# EAGLE design op-synth 0.83 bigger mounting holes (EAGLE 6.6.0)
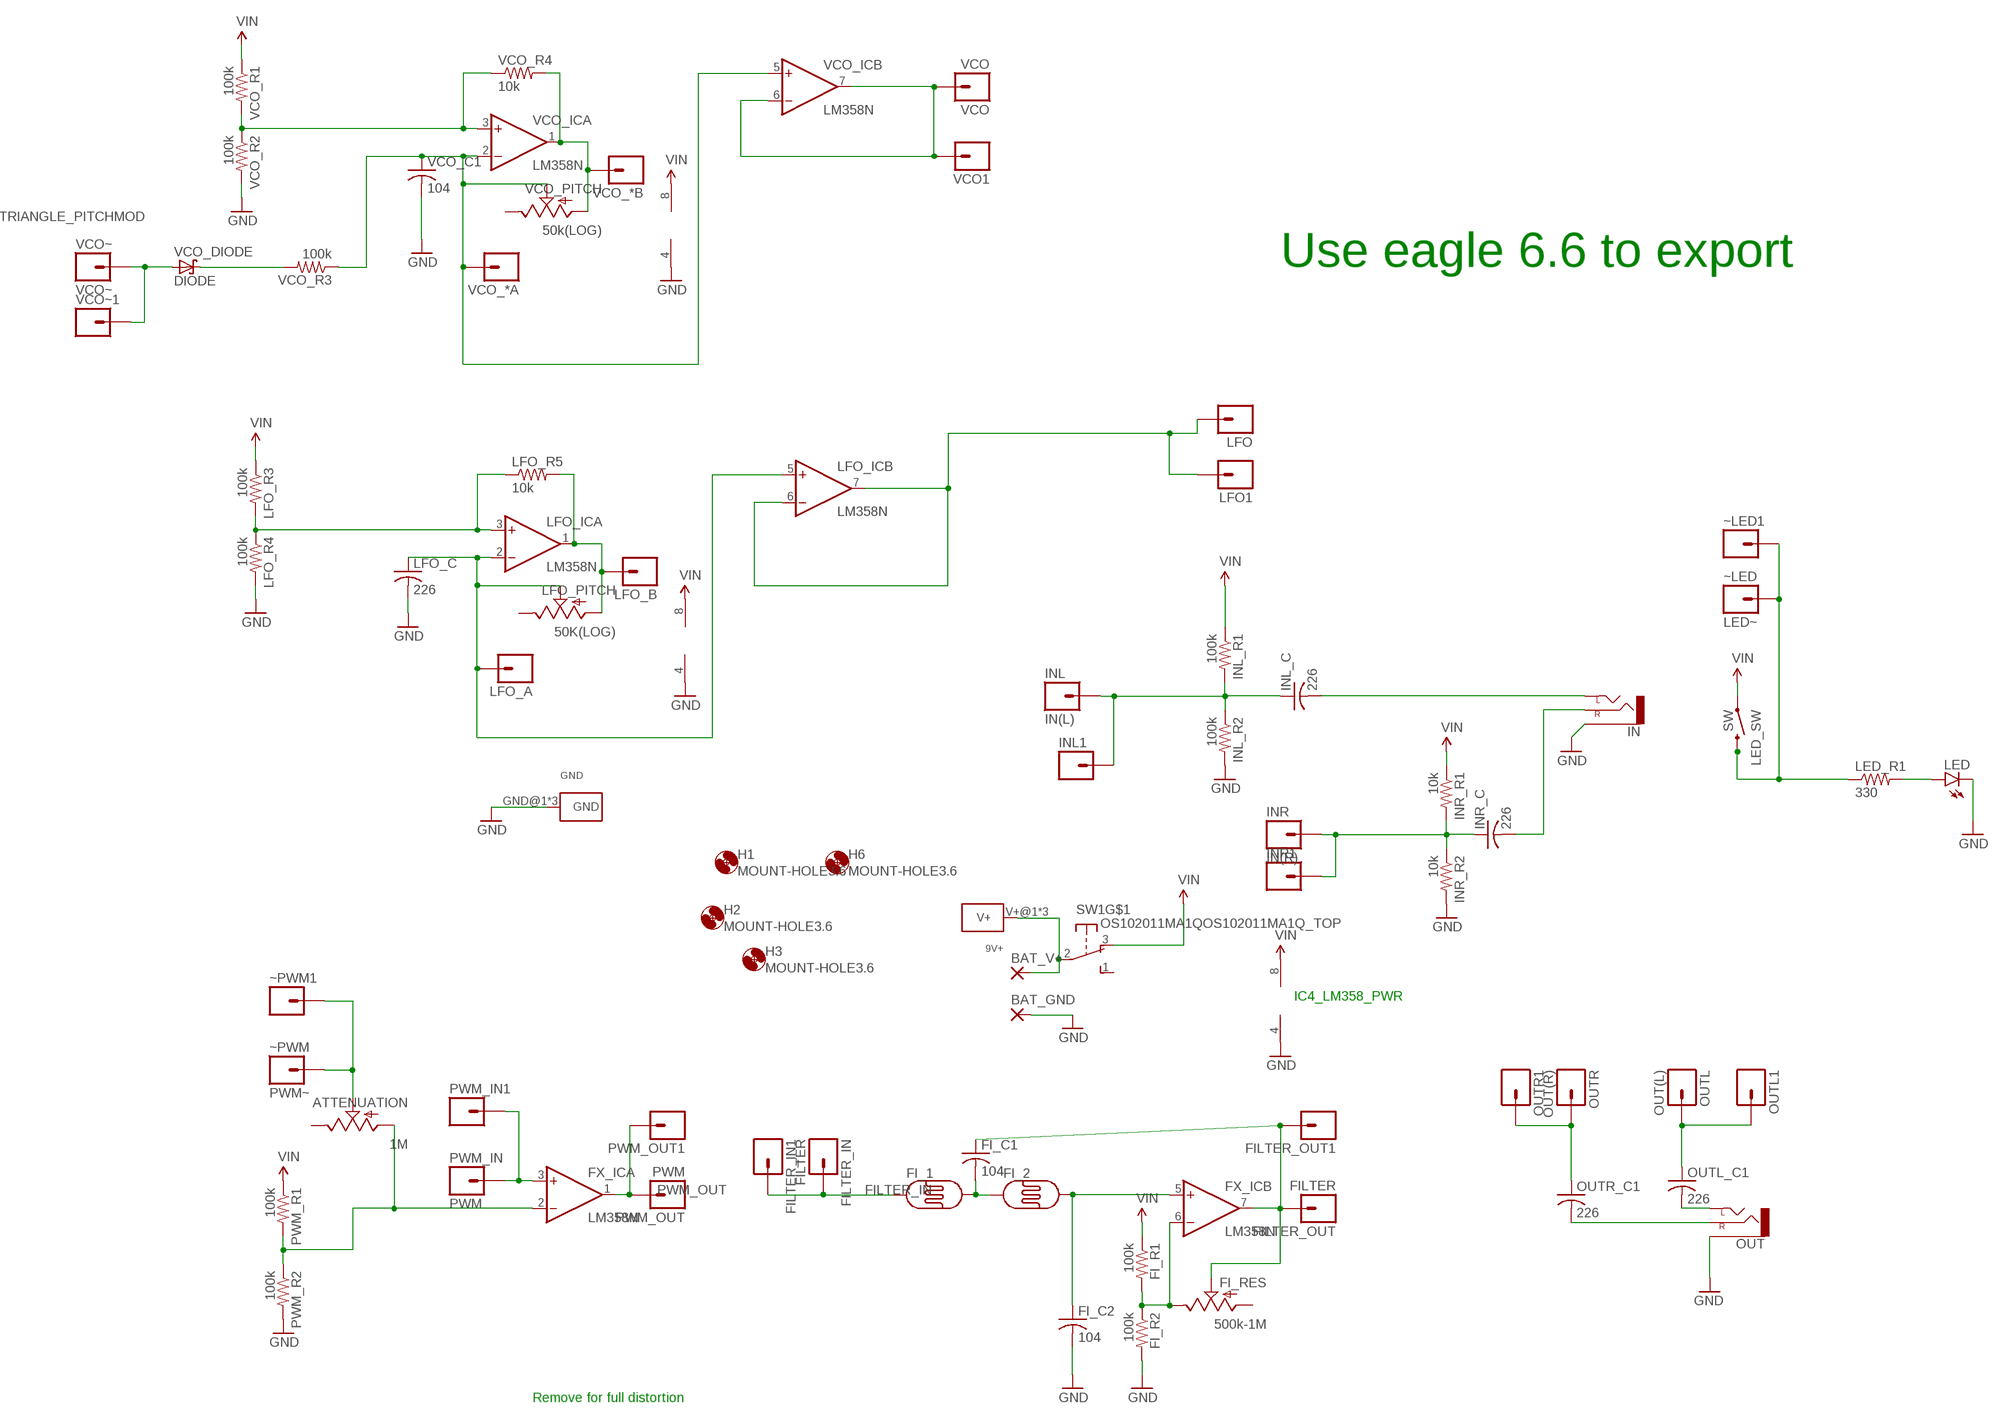
[diagram p0: schematic, sheet 1]

## Parts
9V+  KEYSTONE-629+  [KEYSTONE_BATTAERY_TERMINAL-629+]
ATTENUATION  1M  POTTRIM  [TRIM_POT]
BAT_GND  3,81/1,4  [3,81/1,4]
BAT_V+  3,81/1,4  [3,81/1,4]
FI_1  PHOTOCELLPTH  [PHOTOCELL]
FI_2  PHOTOCELLPTH  [PHOTOCELL]
FI_C1  104  C-US050-024X044  [C050-024X044]
FI_C2  104  C-US050-024X044  [C050-024X044]
FI_R1  100k  R-US_0204/7  [0204/7]
FI_R2  100k  R-US_0204/7  [0204/7]
FI_RES  500k-1M  POT  [ALPS_POT]
FILTER_IN  FILTER  HEADER-1X1  [1X01_SIDE_NAME]
FILTER_IN1  HEADER-1X1  [1X01_SIDE_NAME]
FILTER_OUT  FILTER  HEADER-1X1  [1X01_SIDE_NAME]
FILTER_OUT1  HEADER-1X1  [1X01_SIDE_NAME]
FX_IC  LM358N  [DIL08]
GND  KEYSTONE-629  [KEYSTONE_AA_AAA_BATTERY_TERMINAL-629]
H1  MOUNT-HOLE3.6  [3,6]
H2  MOUNT-HOLE3.6  [3,6]
H3  MOUNT-HOLE3.6  [3,6]
H6  MOUNT-HOLE3.6  [3,6]
IN  AUDIO-JACKPTH  [AUDIO-JACK]
INL  IN(L)  HEADER-1X1  [1X01_SIDE_NAME]
INL1  HEADER-1X1  [1X01_SIDE_NAME]
INL_C  226  C-US050-024X044  [C050-024X044]
INL_R1  100k  R-US_0204/7  [0204/7]
INL_R2  100k  R-US_0204/7  [0204/7]
INR  IN(R)  HEADER-1X1  [1X01_SIDE_NAME]
INR1  HEADER-1X1  [1X01_SIDE_NAME]
INR_C  226  C-US050-024X044  [C050-024X044]
INR_R1  10k  R-US_0204/7  [0204/7]
INR_R2  10k  R-US_0204/7  [0204/7]
LED  LED5MM  [LED5MM]
LED_R1  330  R-US_0204/7  [0204/7]
LED_SW  SW  SWITCH-MOMENTARY-212MM  [TACTILE-PTH-12MM]
LFO  HEADER-1X1  [1X01_SIDE_NAME]
LFO1  HEADER-1X1  [1X01_SIDE_NAME]
LFO_A  HEADER-1X1  [1X01_SIDE_NAME]
LFO_B  HEADER-1X1  [1X01_SIDE_NAME]
LFO_C  226  C-US050-024X044  [C050-024X044]
LFO_IC  LM358N  [DIL08]
LFO_PITCH  50K(LOG)  POT  [ALPS_POT]
LFO_R3  100k  R-US_0204/7  [0204/7]
LFO_R4  100k  R-US_0204/7  [0204/7]
LFO_R5  10k  R-US_0204/7  [0204/7]
OUT  AUDIO-JACKPTH  [AUDIO-JACK]
OUTL  OUT(L)  HEADER-1X1  [1X01_SIDE_NAME]
OUTL1  HEADER-1X1  [1X01_SIDE_NAME]
OUTL_C1  226  C-US050-024X044  [C050-024X044]
OUTR  OUT(R)  HEADER-1X1  [1X01_SIDE_NAME]
OUTR1  HEADER-1X1  [1X01_SIDE_NAME]
OUTR_C1  226  C-US050-024X044  [C050-024X044]
PWM_IN  PWM  HEADER-1X1  [1X01_SIDE_NAME]
PWM_IN1  HEADER-1X1  [1X01_SIDE_NAME]
PWM_OUT  PWM  HEADER-1X1  [1X01_SIDE_NAME]
PWM_OUT1  HEADER-1X1  [1X01_SIDE_NAME]
PWM_R1  100k  R-US_0204/7  [0204/7]
PWM_R2  100k  R-US_0204/7  [0204/7]
SW1  OS102011MA1QOS102011MA1Q_TOP  [OS102011MA1Q]
VCO  VCO  HEADER-1X1  [1X01_SIDE_NAME]
VCO1  HEADER-1X1  [1X01_SIDE_NAME]
VCO_*A  HEADER-1X1  [1X01_SIDE_NAME]
VCO_*B  HEADER-1X1  [1X01_SIDE_NAME]
VCO_C1  104  C-US050-024X044  [C050-024X044]
VCO_DIODE  DIODE  SCHOTTKY-DIODEDO41-7  [DO41-7]
VCO_IC  LM358N  [DIL08]
VCO_PITCH  50k(LOG)  POT  [ALPS_POT]
VCO_R1  100k  R-US_0204/7  [0204/7]
VCO_R2  100k  R-US_0204/7  [0204/7]
VCO_R3  100k  R-US_0204/7  [0204/7]
VCO_R4  10k  R-US_0204/7  [0204/7]
VCO~  VCO~  HEADER-1X1  [1X01_SIDE_NAME]
VCO~1  HEADER-1X1  [1X01_SIDE_NAME]
~LED  LED~  HEADER-1X1  [1X01_SIDE_NAME]
~LED1  HEADER-1X1  [1X01_SIDE_NAME]
~PWM  PWM~  HEADER-1X1  [1X01_SIDE_NAME]
~PWM1  HEADER-1X1  [1X01_SIDE_NAME]

## Nets
FILTER_IN: FI_1.1 FILTER_IN1.1 FILTER_IN.1
FILTER_OUT: FI_C1.1 FI_RES.P$2(S) FILTER_OUT1.1 FILTER_OUT.1 FX_IC.7(B:OUT)
GND: BAT_GND.1(P) FI_C2.2 FI_R2.2 FX_IC.4(P:V-) GND.GND@1(GND) GND.GND@2(GND) GND.GND@3(GND) IN.SLEEVE INL_R2.2 INR_R2.2 LED.K(C) LFO_C.2 LFO_IC.4(P:V-) LFO_R4.2 OUT.SLEEVE PWM_R2.2 VCO_C1.2 VCO_IC.4(P:V-) VCO_R2.2
LFO: LFO1.1 LFO.1 LFO_IC.6(B:-IN) LFO_IC.7(B:OUT)
MOD_IN: FX_IC.3(A:+IN) PWM_IN1.1 PWM_IN.1
N$1: 9V+.V+@1(V+) 9V+.V+@2(V+) 9V+.V+@3(V+) BAT_V+.1(P) SW1.2(P)
N$2: VCO_DIODE.C VCO_R3.2
N$3: ATTENUATION.1(S) ~PWM1.1 ~PWM.1
N$4: VCO_IC.3(A:+IN) VCO_R1.2 VCO_R2.1 VCO_R4.1
N$5: ATTENUATION.3(A) FX_IC.2(A:-IN) PWM_R1.2 PWM_R2.1
N$6: LED.A LED_R1.2
N$7: FI_2.2 FI_C2.1 FX_IC.5(B:+IN)
N$8: FI_1.2 FI_2.1 FI_C1.2
N$9: OUTR1.1 OUTR.1 OUTR_C1.1
N$10: VCO_*B.1 VCO_IC.1(A:OUT) VCO_PITCH.P$3(A) VCO_R4.2
N$11: OUT.TIP(LEFT) OUTL_C1.2
N$12: OUTL1.1 OUTL.1 OUTL_C1.1
N$13: LED_R1.1 LED_SW.3 ~LED1.1 ~LED.1
N$14: INR1.1 INR.1 INR_C.1 INR_R1.2 INR_R2.1
N$15: IN.RING(RIGHT) INR_C.2
N$16: FI_R1.2 FI_R2.1 FI_RES.P$1(E) FX_IC.6(B:-IN)
N$17: LFO_IC.3(A:+IN) LFO_R3.2 LFO_R4.1 LFO_R5.1
N$18: VCO_*A.1 VCO_C1.1 VCO_IC.2(A:-IN) VCO_IC.5(B:+IN) VCO_PITCH.P$2(S) VCO_R3.1
N$19: INL1.1 INL.1 INL_C.1 INL_R1.2 INL_R2.1
N$20: IN.TIP(LEFT) INL_C.2
N$21: LFO_B.1 LFO_IC.1(A:OUT) LFO_PITCH.P$3(A) LFO_R5.2
N$22: LFO_A.1 LFO_C.1 LFO_IC.2(A:-IN) LFO_IC.5(B:+IN) LFO_PITCH.P$2(S)
N$23: VCO1.1 VCO.1 VCO_IC.6(B:-IN) VCO_IC.7(B:OUT)
N$24: OUT.RING(RIGHT) OUTR_C1.2
PWM_OUT: FX_IC.1(A:OUT) PWM_OUT1.1 PWM_OUT.1
TRIANGLE_PITCHMOD: VCO_DIODE.A VCO~1.1 VCO~.1
VIN: FI_R1.1 FX_IC.8(P:V+) INL_R1.1 INR_R1.1 LED_SW.1 LFO_IC.8(P:V+) LFO_R3.1 PWM_R1.1 SW1.3(O) VCO_IC.8(P:V+) VCO_R1.1
Unconnected: ATTENUATION.2(E) FI_RES.P$3(A) LFO_PITCH.P$1(E) SW1.1(S) SW1.MT1(MT) SW1.MT2(MT) VCO_PITCH.P$1(E)

## Notes on the sheet
- Use eagle 6.6 to export
- IC4_LM358_PWR
- Remove for full distortion

## Library data of the parts
9V+ = kanflo:KEYSTONE-629+
ATTENUATION = SparkFun-Electromechanical:POT
BAT_GND BAT_V+ = wirepad:3,81/1,4: THROUGH-HOLE PAD
FI_1 FI_2 = SparkFun-Sensors:PHOTOCELL: CdS photoresistor. This is a low cost way to detect light levels. Resistance decreases with more incoming light. SparkFun SKU: SEN-09088
FI_C1 FI_C2 LFO_C = resistor:C-US: CAPACITOR, American symbol
FI_R1 FI_R2 INL_R1 INL_R2 INR_R1 INR_R2 LED_R1 LFO_R3-LFO_R5 PWM_R1 PWM_R2 VCO_R1-VCO_R4 = resistor:R-US_: RESISTOR, American symbol
FI_RES LFO_PITCH VCO_PITCH = SparkFun-Electromechanical:POT; PROD_ID: RES-09177
FILTER_IN FILTER_IN1 FILTER_OUT FILTER_OUT1 INL INL1 INR INR1 LFO LFO1 LFO_A LFO_B OUTL OUTL1 OUTR OUTR1 PWM_IN PWM_IN1 PWM_OUT PWM_OUT1 VCO VCO1 VCO_*A VCO_*B VCO~ VCO~1 ~LED ~LED1 ~PWM ~PWM1 = TOF:HEADER-1X1: Header 1 Standard 1-pin 0.1" header. Use with straight break away headers (SKU : PRT-00116), right angle break away headers (PRT-00553), swiss pins (PRT-00743), machine pins (PRT-00117), and female headers (PRT-00115).
FX_IC LFO_IC VCO_IC = linear:LM358: OP AMP also LM158; LM258; LM2904 Source: http://cache.national.com/ds/LM/LM158.pdf
GND = kanflo:KEYSTONE-629: Keystone 629 PCB Mount Battery Contact for 1 (AA), 1 (AAA), 1 (N), Coil Spring Contact Links Data sheet <http://docs-europe.electrocomponents.com/webdocs/002e/0900766b8002ef6f.pdf> RS Online <http://se.rs-online.com/web/p/battery-holders-mounts/2050057/>
H1-H3 H6 = holes:MOUNT-HOLE: MOUNTING HOLE with drill center marker
IN OUT = SparkFun-Connectors:AUDIO-JACK: 3.5mm Audio Jack Simple 3.5mm common PCB mount audio jack. Variant PTH is our storefront SKU PRT-08032
INL_C INR_C OUTL_C1 OUTR_C1 VCO_C1 = adafruit:C-US: CAPACITOR, American symbol
LED = SparkFun-LED:LED: LEDs Standard schematic elements and footprints for 5mm, 3mm, 1206, and 0603 sized LEDs. 5mm - Spark Fun Electronics SKU : COM-00529 (and others)
LED_SW = SparkFun-Electromechanical:SWITCH-MOMENTARY-2: Various NO switches- pushbuttons, reed, etc; PROD_ID: SWCH-09185
SW1 = TOF:OS102011MA1Q: OS10201MA1Q through-hole right angle switch http://www.ladyada.net/library/eagle
VCO_DIODE = adafruit:SCHOTTKY-DIODE: Schottky Diode

## Board
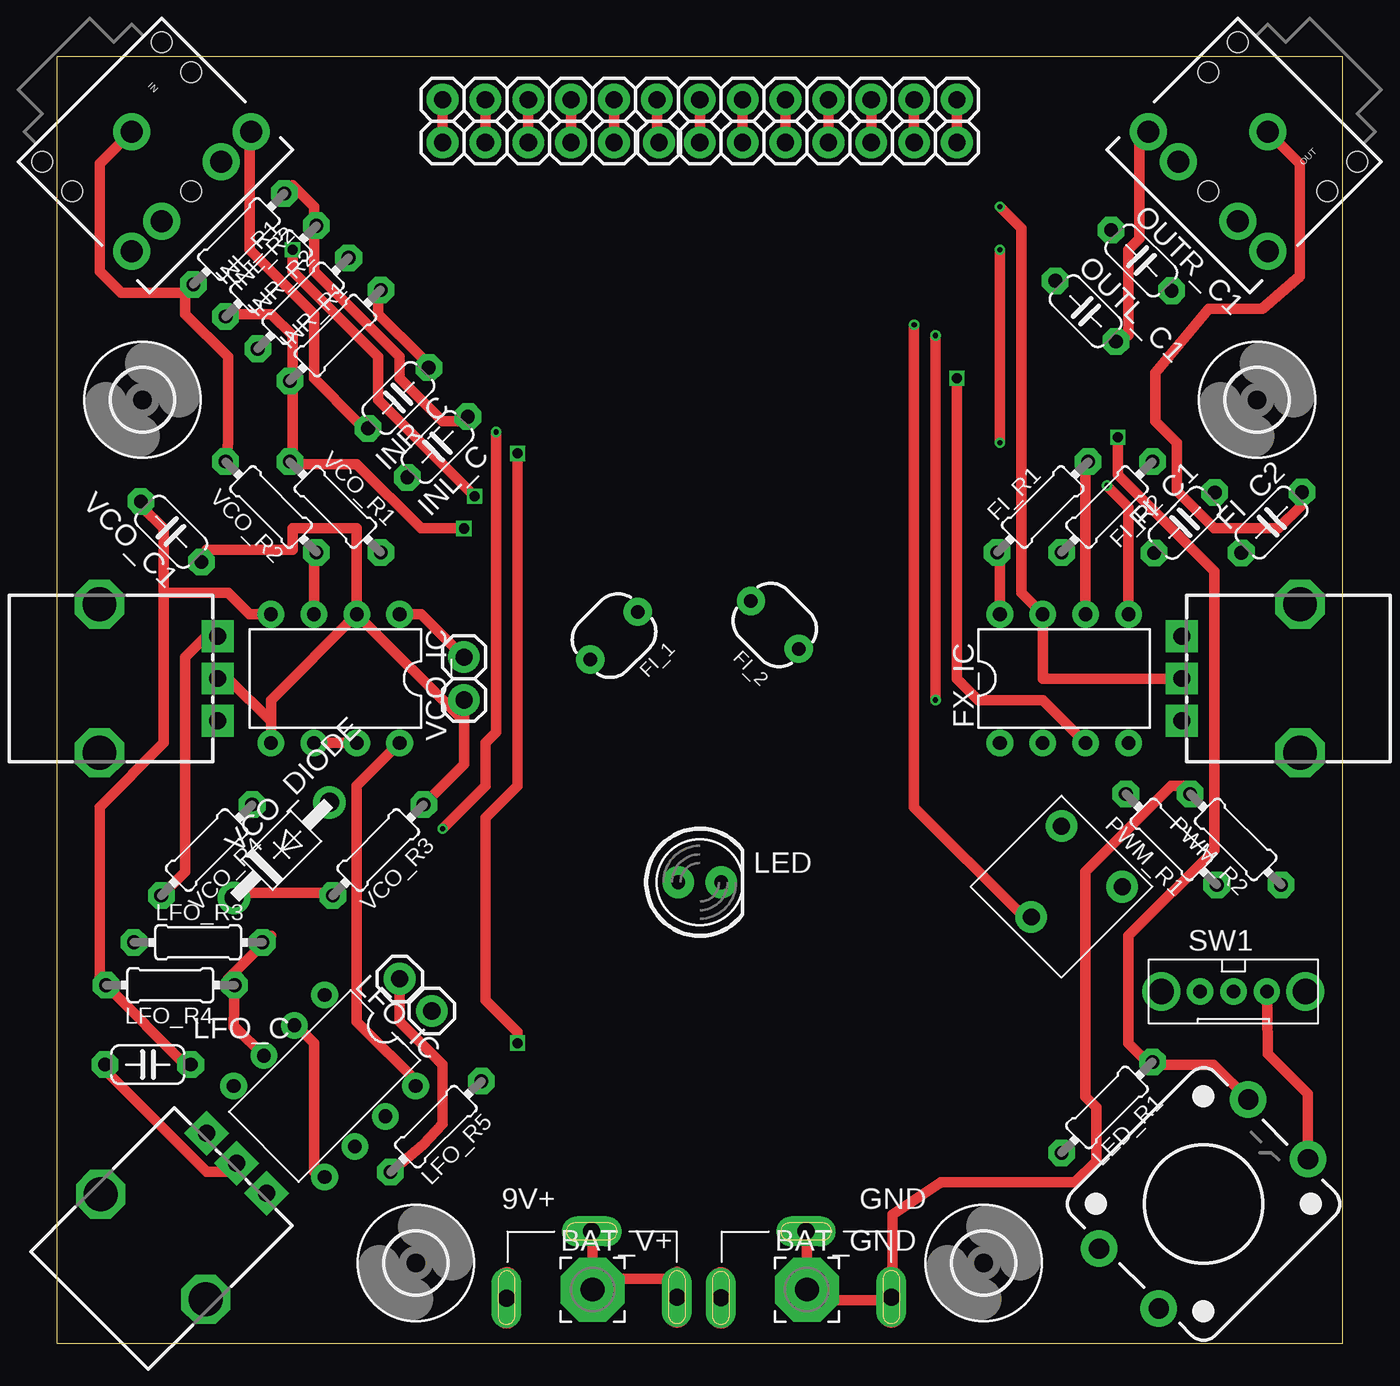
[diagram p1: board, top side]
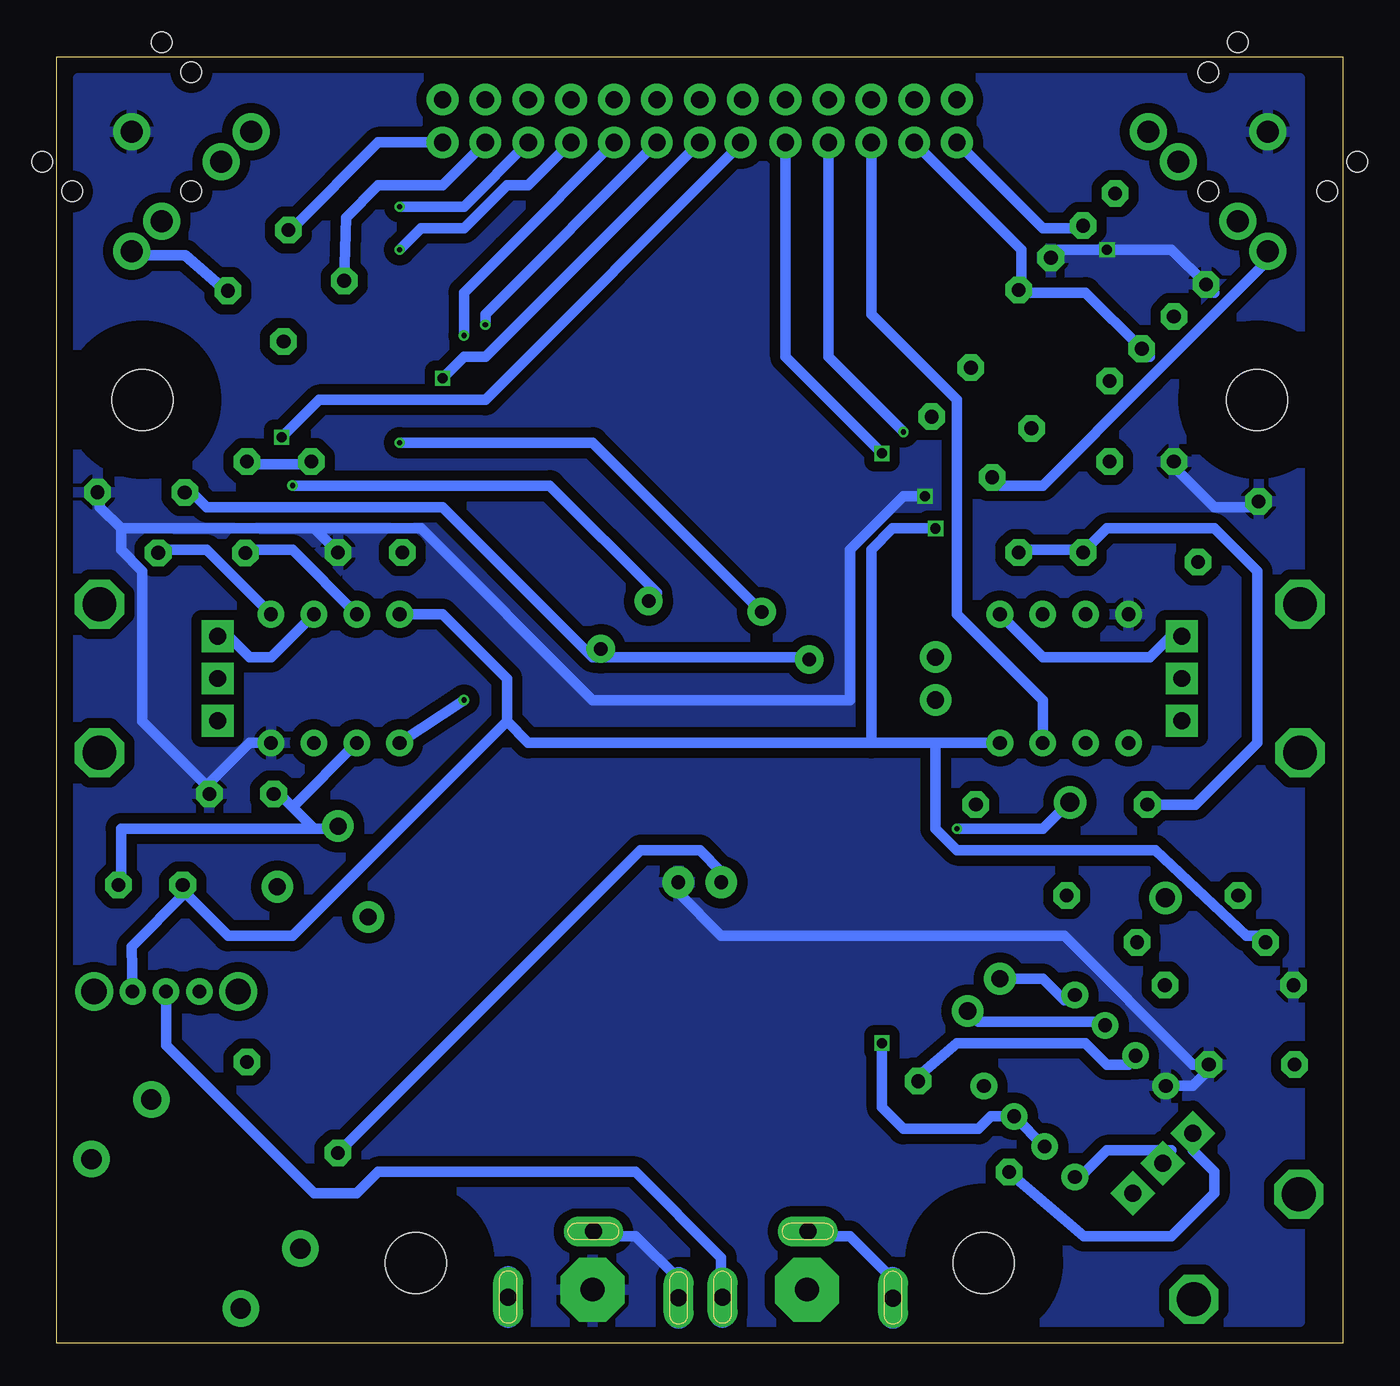
[diagram p2: board, bottom side, seen from below]

Size 76.2 x 76.2 mm. Coordinates in mm from the lower left corner, seen from the top.
Outline: 0,0 76.2,0 76.2,76.2 0,76.2 0,0
Copper layers (1*16): Top 0.035mm / dielectric 1.5mm / Bottom 0.035mm
Design rules "EagleRules *": minimum track width 18mil, minimum drill 12mil, track to track 7mil, track to pad 12mil, pad to pad 12mil, via to via 7mil, smd to smd 0mil, copper to edge 25mil, drill to drill 10mil, minimum pad ring 15mil, minimum via ring 6mil, stop-mask expansion 2mil, vias tented up to drill 25mil, thermal gap 10mil
tRestrict: area 21.6,61 to 54.6,69.8; area 26.7,7.6 to 50.2,61

### Footprints (pad centres in the part's own frame; a part is rotated, then mirrored left to right if it is on the bottom)
KEYSTONE_BATTAERY_TERMINAL-629+ = drill 1 pad 1.5 long: V+@1 5,-0.449; V+@2 -0.05,3.45; V+@3 -5.1,-0.499
TRIM_POT = drill 1 pad 1.88: 1 5.08,0; 2 0,2.54; 3 0,-2.54
3,81/1,4 = drill 1.397 pad 3.81 octagon: 1 0,0
PHOTOCELL = drill 0.8 pad 1.676: 1 -2,0; 2 2,0
C050-024X044 = drill 0.813 octagon: 1 -2.54,0; 2 2.54,0
0204/7 = drill 0.813 octagon: 1 -3.81,0; 2 3.81,0
ALPS_POT = drill 1 pad 1.88 square: P$1 7,-2.5; P$2 7,0; P$3 7,2.5 | drill 2 octagon: P$4 0,-4.4; P$5 0,4.4
1X01_SIDE_NAME = drill 1.016 pad 1.88: 1 0,0
DIL08 = drill 0.813 pad 1.27: 1 -3.81,-3.81; 2 -1.27,-3.81; 3 1.27,-3.81; 4 3.81,-3.81; 5 3.81,3.81; 6 1.27,3.81; 7 -1.27,3.81; 8 -3.81,3.81
KEYSTONE_AA_AAA_BATTERY_TERMINAL-629 = drill 1 pad 1.5 long: GND@1 5,-0.436; GND@2 -0.05,3.45; GND@3 -5.1,-0.486
3,6 = hole 3.6: 0,0
AUDIO-JACK = drill 1.3 pad 2.184: RING 5,5; RSH 5,2.5; SLEEVE 0,0; TIP 5,-5; TSH 5,-2.5 | hole 1.2: 0,5; -2.5,5; -2.5,-5; 0,-5; 5,0
LED5MM = drill 0.813 pad 1.88: A -1.27,0; K 1.27,0
TACTILE-PTH-12MM = drill 1.2 pad 2.159: 1 6.25,-2.5; 2 -6.25,-2.5; 3 6.25,2.5; 4 -6.25,2.5
OS102011MA1Q = drill 0.8 pad 1.422: 1 -1.981,0; 2 0,0; 3 1.981,0 | drill 1.5 pad 2.184: MT1 -4.267,0; MT2 4.267,0
DO41-7 = drill 1.118 pad 1.93: A 4,0; C -4,0

### Placement (x,y rotation side)
9V+  31.75,3.17 0 top
ATTENUATION  61.33,28.84 225 top
BAT_GND  44.45,3.17 0 top
BAT_V+  31.75,3.17 0 top
FI_1  33.02,41.91 225 top
FI_2  42.55,42.55 135 top
FI_C1  66.82,48.59 45 top
FI_C2  71.98,48.61 45 top
FI_R1  58.42,49.53 45 top
FI_R2  62.23,49.53 225 top
FI_RES  73.66,39.37 180 top
FILTER_IN  45.72,71.12 270 top
FILTER_IN1  45.72,73.66 90 top
FILTER_OUT  48.26,71.12 270 top
FILTER_OUT1  48.26,73.66 90 top
FX_IC  59.69,39.37 0 top
GND  44.45,3.17 0 top
H1  71.12,55.88 0 top
H2  21.27,4.76 0 top
H3  54.93,4.76 0 top
H6  5.08,55.88 0 top
IN  4.45,71.75 315 top
INL  22.86,71.12 270 top
INL1  22.86,73.66 90 top
INL_C  22.56,53.09 225 top
INL_R1  12.7,63.5 45 top
INL_R2  10.79,65.41 225 top
INR  25.4,71.12 270 top
INR1  25.4,73.66 90 top
INR_C  20.24,55.99 225 top
INR_R1  16.51,59.69 45 top
INR_R2  14.61,61.59 45 top
LED  38.1,27.3 0 top
LED_R1  62.23,13.97 225 top
LED_SW  67.94,8.26 45 top
LFO  33.02,71.12 270 top
LFO1  33.02,73.66 0 top
LFO_A  22.23,19.68 45 top
LFO_B  20.32,21.59 315 top
LFO_C  5.4,16.51 0 top
LFO_IC  15.88,15.24 225 top
LFO_PITCH  5.71,5.71 45 top
LFO_R3  8.38,23.75 0 top
LFO_R4  6.73,21.21 180 top
LFO_R5  22.47,12.83 225 top
OUT  71.75,71.75 225 top
OUTL  50.8,71.12 270 top
OUTL1  50.8,73.66 90 top
OUTL_C1  60.96,61.13 315 top
OUTR  53.34,71.12 270 top
OUTR1  53.34,73.66 90 top
OUTR_C1  64.26,64.13 315 top
PWM_IN  38.1,71.12 270 top
PWM_IN1  38.1,73.66 90 top
PWM_OUT  43.18,71.12 270 top
PWM_OUT1  43.18,73.66 90 top
PWM_R1  66.04,29.84 135 top
PWM_R2  69.85,29.84 135 top
SW1  69.72,20.83 0 top
VCO  27.94,71.12 270 top
VCO1  27.94,73.66 90 top
VCO_*A  24.13,38.1 0 top
VCO_*B  24.13,40.64 270 top
VCO_C1  6.78,48.07 135 top
VCO_DIODE  13.34,29.21 45 top
VCO_IC  16.51,39.37 180 top
VCO_PITCH  2.54,39.37 0 top
VCO_R1  16.51,49.53 315 top
VCO_R2  12.7,49.53 135 top
VCO_R3  19.05,29.21 225 top
VCO_R4  8.89,29.21 225 top
VCO~  30.48,71.12 270 top
VCO~1  30.48,73.66 90 top
~LED  35.69,71.12 270 top
~LED1  35.56,73.66 90 top
~PWM  40.64,71.12 270 top
~PWM1  40.64,73.66 90 top

### Tracks (layer width: path | path; a pad name or v marks a point on that pad's centre or on a via)
FILTER_IN  (via drill 0.3)
  Top 0.61: v55.88,64.77 v55.88,53.34 | FILTER_IN.1 FILTER_IN1.1
  Bottom 0.61: v55.88,53.34 44.45,53.34 FI_1.1 34.29,43.18 | v55.88,64.77 54.61,66.04 52.07,66.04 49.53,68.58 48.26,68.58 FILTER_IN.1
FILTER_OUT  (via drill 0.3)
  Top 0.61: FILTER_OUT1.1 FILTER_OUT.1 | FI_RES.P$2 58.42,39.37 FX_IC.7 57.15,44.45 57.15,66.04 v55.88,67.31
  Bottom 0.61: FX_IC.7 62.23,46.99 64.77,46.99 FI_C1.1 | FILTER_OUT.1 52.07,67.31 v55.88,67.31
GND  (via drill 0.6)
  Top 0.61: VCO_IC.4 11.43,43.18 10.16,44.45 6.35,44.45 | 6.35,44.45 6.35,48.26 5.08,49.53 VCO_C1.2 | IN.SLEEVE 2.54,69.85 2.54,63.5 3.81,62.23 7.62,62.23 | 7.62,62.23 7.62,60.96 10.16,58.42 10.16,53.34 VCO_R2.2 10.16,52.07 | 7.62,62.23 INL_R2.2 | LFO_C.2 7.62,16.51 LFO_R4.2 2.54,21.59 2.54,31.75 6.35,35.56 6.35,44.45 | GND.GND@2 44.45,6.35 BAT_GND.1 44.45,2.54 49.53,2.54 GND.GND@1 | OUT.SLEEVE 73.66,69.85 73.66,63.18 71.44,61.28 68.26,61.28 65.09,57.47 65.09,54.61 66.36,53.34 66.36,50.48 68.58,48.26 72.39,48.26 73.78,49.65 FI_C2.2 | 49.53,3.81 GND.GND@1 | PWM_R2.2 67.31,33.02 66.04,33.02 60.96,27.94 60.96,14.61 61.59,13.97 61.59,10.79 60.33,9.53 52.39,9.53 49.53,7.62 49.53,2.82 GND.GND@1 | v24.77,50.16 19.05,55.88 19.05,58.42 13.97,63.5 v13.97,64.77
  Bottom 0.61: VCO_R2.2 10.16,52.07 7.62,49.53 5.08,49.53 VCO_C1.2 | LFO_IC.4 8.89,15.24 7.62,16.51 LFO_C.2 8.89,16.51 16.51,24.13 36.83,24.13 39.37,26.67 LED.K | GND.GND@3 39.37,3.81 41.91,6.35 43.18,6.35 GND.GND@2 | 67.31,33.02 64.77,35.56 FX_IC.4 | 60.96,48.26 FI_R2.2 | 72.39,48.26 60.96,48.26 | 72.39,48.26 73.66,49.53 73.66,50.29 FI_C2.2 | 67.31,33.02 71.12,36.83 71.12,45.72 72.39,46.99 72.39,48.26 | 67.31,33.02 PWM_R2.2 | 60.96,48.26 54.61,48.26 44.45,38.1 29.21,38.1 29.21,46.99 26.04,50.16 v24.77,50.16 | 7.62,62.23 INL_R2.2 10.16,64.77 v13.97,64.77 16.82,64.77 INR_R2.2
  pour Bottom (isolate 0.61): 2.54,74.93 74.93,74.93 74.93,1.27 2.54,1.27
LFO  (via drill 0.6)
  Top 0.61: LFO1.1 LFO.1 | v27.3,17.78 27.3,18.41 25.4,20.32 25.4,31.11 27.3,33.02 v27.3,52.7
  Bottom 0.61: LFO_IC.6 LFO_IC.7 20.85,13.44 21.59,12.7 26.04,12.7 27.3,13.97 v27.3,17.78 | v27.3,52.7 33.02,58.42 LFO.1
MOD_IN  (via drill 0.6)
  Top 0.61: PWM_IN.1 PWM_IN1.1 | FX_IC.3 58.42,38.1 54.61,38.1 53.34,39.37 v53.34,57.15
  Bottom 0.61: PWM_IN.1 50.8,58.42 52.07,58.42 v53.34,57.15
N$1
  Top 0.61: 31.75,3.81 31.75,6.35 9V+.V+@2 | 31.75,3.81 36.83,3.81 9V+.V+@1 | 31.75,3.81 BAT_V+.1
  Bottom 0.61: 9V+.V+@3 26.67,3.81 29.21,6.35 30.48,6.35 9V+.V+@2 | 9V+.V+@1 36.83,3.81 36.83,5.08 41.91,10.16 57.15,10.16 58.42,8.89 60.96,8.89 69.72,17.65 69.72,20.19 69.85,20.32 SW1.2
N$2
  Top 0.61: VCO_R3.2 16.51,26.67 11.43,26.67 VCO_DIODE.C
N$3  (via drill 0.3)
  Top 0.61: ~PWM1.1 ~PWM.1 | v50.8,60.33 50.8,31.75 57.15,25.4 ATTENUATION.1
  Bottom 0.61: ~PWM.1 50.8,60.96 v50.8,60.33
N$4
  Top 0.61: VCO_IC.3 15.24,46.99 VCO_R2.1
  Bottom 0.61: VCO_R1.2 19.05,46.99 15.24,46.99 VCO_R2.1 13.97,48.26 7.62,48.26 5.08,45.72 5.08,35.56 8.74,31.9 VCO_R4.1
N$5
  Bottom 0.61: 60.96,30.48 62.23,31.75 | 62.23,31.75 63.5,33.02 PWM_R1.2 | 60.96,30.48 59.69,30.48 ATTENUATION.3 | 62.23,31.75 FX_IC.2 | 60.96,30.48 72.39,30.48 72.39,26.67 PWM_R2.1
N$6
  Top 0.61: 59.69,11.43 LED_R1.2
  Bottom 0.61: LED.A 36.83,27.94 38.1,29.21 41.6,29.21 LED_R1.2
N$7  (via drill 0.3)
  Top 0.61: v62.23,50.8 63.5,49.53 FX_IC.5
  Bottom 0.61: FX_IC.5 67.31,46.99 69.85,46.99 FI_C2.1 | v62.23,50.8 46.99,50.8 40.64,44.45 FI_2.2
N$8
  Bottom 0.61: 44.45,40.64 53.34,49.53 67.31,49.53 68.58,50.8 FI_C1.2 | 44.45,40.64 31.75,40.64 FI_1.2 | 44.45,40.64 FI_2.1
N$9
  Top 0.61: OUTR.1 OUTR1.1
  Bottom 0.61: OUTR.1 57.15,71.12 62.23,66.04 OUTR_C1.1
N$10
  Top 0.61: VCO_IC.1 21.59,43.18 VCO_*B.1 | VCO_R4.2 7.62,27.94 7.62,40.64 8.89,41.91 9.5,41.91 VCO_PITCH.P$3
  Bottom 0.61: VCO_IC.1 17.78,40.64 11.43,40.64 10.16,41.91 VCO_PITCH.P$3
N$11
  Top 0.61: OUTL_C1.2 63.5,59.69 63.5,64.77 64.14,65.41 64.14,71.44 OUT.TIP
N$12
  Top 0.61: OUTL.1 OUTL1.1
  Bottom 0.61: OUTL.1 53.34,68.58 57.15,68.58 59.05,66.67 OUTL_C1.1
N$13  (via drill 0.6)
  Top 0.61: ~LED1.1 35.56,71.12 ~LED.1 | 64.77,16.51 63.5,17.78 63.5,24.13 68.58,29.21 68.58,45.72 62.87,51.44 v62.87,53.66 | 64.77,16.51 LED_R1.1 | 64.77,16.51 68.53,16.51 LED_SW.3
  Bottom 0.61: 64.77,16.51 LED_R1.1 | ~LED.1 35.56,71.12 50.8,55.88 60.64,55.88 v62.87,53.66
N$14
  Top 0.61: INR1.1 INR.1 | INR_C.1 21.59,58.42 19.05,60.96 19.05,62.23 INR_R1.2
  Bottom 0.61: 19.05,62.23 15.24,62.23 INR_R2.1 11.43,58.42 | INR.1 19.05,64.77 19.05,62.23 | 19.05,62.23 INR_R1.2
N$15
  Top 0.61: INR_C.2 17.78,54.61 15.24,57.15 15.24,60.96 11.43,64.77 11.43,71.12 IN.RING
N$16
  Top 0.61: FX_IC.6 60.96,52.07 FI_R1.2
  Bottom 0.61: FI_R2.1 64.77,52.07 60.96,52.07 FI_R1.2 | FX_IC.6 63.5,40.64 64.77,40.64 66.04,41.91 FI_RES.P$1
N$17
  Top 0.61: LFO_R3.2 12.7,24.13 10.16,21.59 LFO_R4.1 10.48,18.73 10.59,18.73 LFO_IC.3
  Bottom 0.61: LFO_R5.1 25.08,15.88 22.86,17.78 15.24,17.78 13.97,16.51 12.7,16.51 LFO_IC.3
N$18
  Top 0.61: VCO_IC.2 12.7,38.1 12.7,36.83 | VCO_IC.5 12.7,36.83 | VCO_IC.2 17.78,48.26 13.97,48.26 13.97,46.99 8.89,46.99 VCO_C1.1 | 12.7,36.83 10.16,39.37 VCO_PITCH.P$2 | VCO_*A.1 24.13,36.83 | 24.13,36.83 24.13,34.29 VCO_R3.1 21.59,31.75 | 24.13,36.83 VCO_IC.2
N$19
  Top 0.61: INL1.1 INL.1 | 15.24,66.04 15.24,63.5 20.32,58.42 20.32,57.15 22.86,54.61 24.09,54.61 INL_C.1 24.13,54.61 | 15.24,66.04 15.24,67.31 13.97,68.58 INL_R2.1 | 15.24,66.04 INL_R1.2
  Bottom 0.61: INL.1 17.78,66.04 15.24,66.04 INL_R1.2
N$20
  Bottom 0.61: IN.TIP 3.81,64.77 11.43,57.15 17.78,50.8 20.28,50.8 INL_C.2
N$21
  Top 0.61: LFO_B.1 20.32,19.05 22.86,16.51 22.86,13.02 21.7,11.75 LFO_R5.2
  Bottom 0.61: LFO_B.1 17.78,21.59 16.51,20.32 LFO_IC.1 | LFO_PITCH.P$3 8.89,11.43 7.62,10.16 7.62,8.89 10.16,6.35 15.35,6.35 LFO_R5.2
N$22
  Top 0.61: LFO_C.1 2.54,16.51 8.89,10.16 10.16,10.16 LFO_PITCH.P$2 | LFO_IC.2 13.97,19.05 15.24,17.78 15.24,10.16 LFO_IC.5
  Bottom 0.61: LFO_IC.2 13.97,19.05 21.59,19.05 LFO_A.1 | LFO_IC.5 15.24,10.16 13.97,11.43 10.16,11.43 LFO_PITCH.P$2
N$23
  Top 0.61: VCO_IC.7 VCO_IC.6 | VCO1.1 VCO.1
  Bottom 0.61: VCO.1 27.94,60.96 22.86,55.88 22.86,43.18 17.78,38.1 VCO_IC.7
N$24
  Bottom 0.61: OUTR_C1.2 66.04,62.23 68.58,64.45 71.12,64.45 OUT.RING
PWM_OUT  (via drill 0.3)
  Top 0.61: v52.07,59.69 v52.07,38.1 | PWM_OUT.1 PWM_OUT1.1
  Bottom 0.61: v52.07,38.1 FX_IC.1 | PWM_OUT.1 49.53,64.77 52.07,62.23 v52.07,59.69
TRIANGLE_PITCHMOD  (via drill 0.3)
  Top 0.61: VCO~1.1 VCO~.1 | v22.86,30.48 25.4,33.02 25.4,35.56 26.04,36.2 26.04,46.99 v26.04,53.98
  Bottom 0.61: v22.86,30.48 17.78,30.48 16.51,31.75 VCO_DIODE.A | v26.04,53.98 30.48,58.42 VCO~.1
VIN  (via drill 0.6)
  Top 0.61: SW1.3 71.75,17.78 71.75,17.14 74.13,14.77 LED_SW.1 | 13.97,57.15 13.97,52.07 | 13.97,52.07 VCO_R1.1 13.97,52.07 | INL_R1.1 10.16,60.96 12.7,60.96 13.97,59.69 13.97,57.15 | FX_IC.8 55.88,46.99 FI_R1.1 | VCO_IC.8 17.78,33.02 17.78,19.05 21.59,15.24 LFO_IC.8 | 13.97,57.15 INR_R1.1 | v24.13,48.26 21.59,48.26 17.78,52.07 13.97,52.07
  Bottom 0.61: 68.58,26.67 71.75,23.5 SW1.3 | 68.58,26.67 PWM_R1.1 | 24.13,35.56 24.13,30.48 22.86,29.21 11.11,29.21 5.71,24.13 5.08,24.13 LFO_R3.1 | VCO_IC.8 24.13,35.56 | 49.53,36.83 48.26,35.56 27.94,35.56 | 24.13,35.56 27.94,35.56 | 27.94,35.56 27.94,46.99 26.67,48.26 v24.13,48.26 | 13.97,52.07 VCO_R1.1 | 49.53,36.83 62.23,24.13 66.04,24.13 68.58,26.67 | 49.53,36.83 49.53,39.37 53.34,43.18 FX_IC.8

### Text on the board
tValues: IN | OUT | FILTER | 50K | 200K+ | PWM | VCO | PWM~+/- | Power | OP- / SYNTH | LED | 50K | LFO
bValues: circuit : thomas o fredericks / illustration : denis raby / op-synth.tofstuff.com | 9V battery
Reference: Use eagle 6.6 to export!